# EAGLE design GKmini_SMD_final (EAGLE 7.5.0)
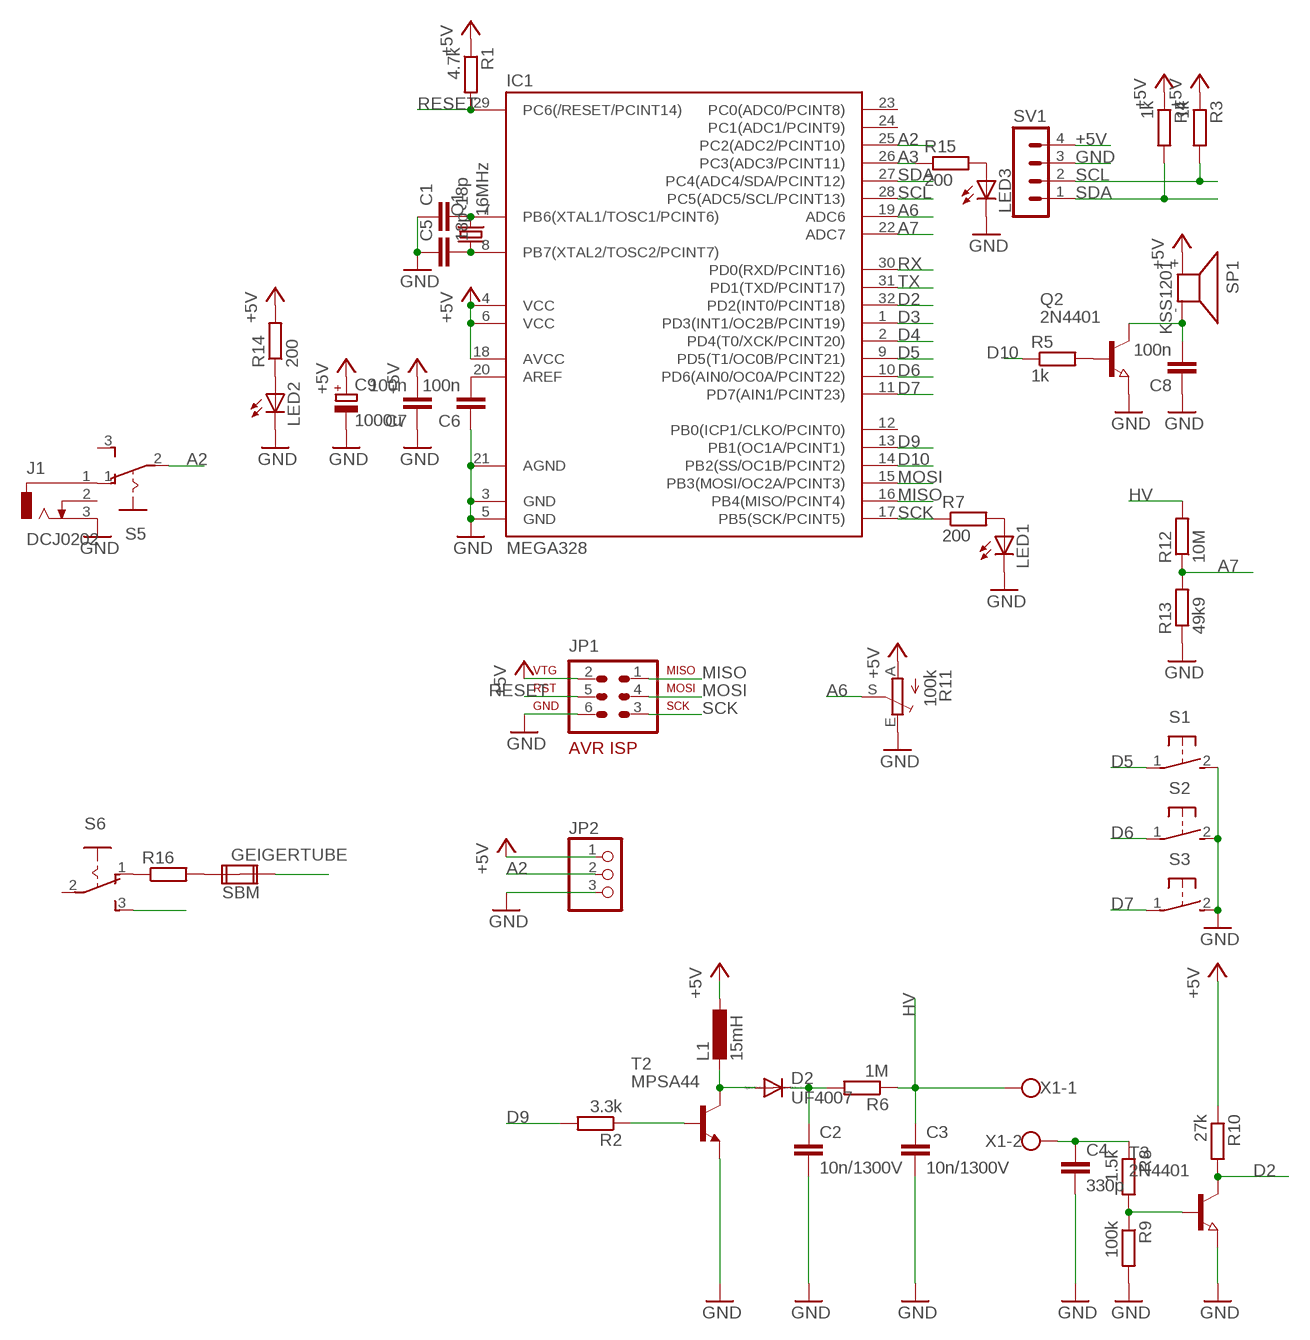
[diagram p0: schematic, sheet 1]

## Parts
C1  18p  C-EUC0805  [C0805]
C2  10n/1300V  C-EU150-054X183  [C150-054X183]
C3  10n/1300V  C-EU150-054X183  [C150-054X183]
C4  330p  C-EUC0805K  [C0805K]
C5  18p  C-EUC0805  [C0805]
C6  100n  C-EUC0805  [C0805]
C7  100n  C-EUC0805  [C0805]
C8  100n  C-EUC0805  [C0805]
C9  1000u  CPOL-EU153CLV-1012  [153CLV-1012]
D2  UF4007  DIODE-C1702-05  [C1702-05]
GEIGERTUBE  SBM  SBM21  [SBM]
IC1  MEGA328  MEGA48/88/168-AU  [TQFP32-08]
J1  DCJ0202  [DCJ0202]
JP1  AVR-ISP-6R  [AVR-ISP-6R]
JP2  PINHD-1X3  [1X03]
L1  15mH  L-EU6000-XXX-RC  [6000-XXXX-RC]
LED1  LED3MM  [LED3MM]
LED2  LED3MM  [LED3MM]
LED3  LED3MM  [LED3MM]
Q1  16MHz  CRYSTALHC49UP  [HC49UP]
Q2  2N4401  NPN-TRANSISTOR_SOT23W  [SOT23W]
R1  4.7k  R-EU_R0805  [R0805]
R2  3.3k  R-EU_R0805  [R0805]
R3  1k  R-EU_R0805  [R0805]
R4  1k  R-EU_R0805  [R0805]
R5  1k  R-EU_R0805  [R0805]
R6  1M  R-EU_0207/5V  [0207/5V]
R7  200  R-EU_R0805  [R0805]
R8  1.5k  R-EU_R0805W  [R0805W]
R9  100k  R-EU_R0805W  [R0805W]
R10  27k  R-EU_R0805W  [R0805W]
R11  100k  TRIM_EU-S64Y  [S64Y]
R12  10M  R-EU_R0805  [R0805]
R13  49k9  R-EU_R0805  [R0805]
R14  200  R-EU_R0805  [R0805]
R15  200  R-EU_R0805  [R0805]
R16  R-EU_R1206W  [R1206W]
S1  31-XX  [B3F-31XX]
S2  31-XX  [B3F-31XX]
S3  31-XX  [B3F-31XX]
S5  255SB  [255SB]
S6  255SB  [255SB]
SP1  KSS1201  [KSS1201]
SV1  MA04-1  [MA04-1]
T2  MPSA44  2N2222  [TO92-EBC-OVAL]
T3  2N4401  NPN-TRANSISTOR_SOT23W  [SOT23W]
X1  W237-102  [W237-102]

## Nets
+5V: C7.2 C9.+ IC1.4(VCC) IC1.6(VCC) IC1.18(AVCC) JP1.2 JP2.1 L1.1 R1.1 R3.1 R4.1 R10.1 R11.A R14.2 SP1.+ SV1.4
A2: IC1.25(PC2(ADC2/PCINT10)) JP2.2 S5.2(P)
A3: IC1.26(PC3(ADC3/PCINT11)) R15.1
A6: IC1.19(ADC6) R11.S
A7: IC1.22(ADC7) R12.1 R13.2
D2: IC1.32(PD2(INT0/PCINT18)) R10.2 T3.2(C)
D3: IC1.1(PD3(INT1/OC2B/PCINT19))
D4: IC1.2(PD4(T0/XCK/PCINT20))
D5: IC1.9(PD5(T1/OC0B/PCINT21)) S1.1(P)
D6: IC1.10(PD6(AIN0/OC0A/PCINT22)) S2.1(P)
D7: IC1.11(PD7(AIN1/PCINT23)) S3.1(P)
D9: IC1.13(PB1(OC1A/PCINT1)) R2.2
D10: IC1.14(PB2(SS/OC1B/PCINT2)) R5.1
GND: C1.1 C2.2 C3.2 C4.2 C5.1 C6.1 C7.1 C8.1 C9.- IC1.3(GND) IC1.5(GND) IC1.21(AGND) J1.3 JP1.6 JP2.3 LED1.K(C) LED2.K(C) LED3.K(C) Q2.3(E) R9.2 R11.E R13.1 S1.2(S) S2.2(S) S3.2(S) SV1.3 T2.E T3.3(E)
HV: C3.1 R6.1 R12.2 X1.1
MISO: IC1.16(PB4(MISO/PCINT4)) JP1.1
MOSI: IC1.15(PB3(MOSI/OC2A/PCINT3)) JP1.4
N$1: C1.2 IC1.7(PB6(XTAL1/TOSC1/PCINT6)) Q1.2
N$2: C5.2 IC1.8(PB7(XTAL2/TOSC2/PCINT7)) Q1.1
N$3: C6.2 IC1.20(AREF)
N$4: Q2.1(B) R5.2
N$5: C8.2 Q2.2(C) SP1.-
N$6: LED1.A R7.2
N$7: D2.A L1.2 T2.C
N$8: C2.1 D2.C R6.2
N$9: LED2.A R14.1
N$10: R2.1 T2.B
N$11: C4.1 R8.1 X1.2
N$12: R8.2 R9.1 T3.1(B)
N$13: R16.1 S6.1(O)
N$14: LED3.A R15.2
N$15: J1.1 S5.1(O)
N$16: GEIGERTUBE.1A R16.2
N$17: S6.3(S)
N$18: GEIGERTUBE.2A
RESET: IC1.29(PC6(/RESET/PCINT14)) JP1.5 R1.2
RX: IC1.30(PD0(RXD/PCINT16))
SCK: IC1.17(PB5(SCK/PCINT5)) JP1.3 R7.1
SCL: IC1.28(PC5(ADC5/SCL/PCINT13)) R3.2 SV1.2
SDA: IC1.27(PC4(ADC4/SDA/PCINT12)) R4.2 SV1.1
TX: IC1.31(PD1(TXD/PCINT17))
Unconnected: GEIGERTUBE.1B GEIGERTUBE.2B IC1.12(PB0(ICP1/CLKO/PCINT0)) IC1.23(PC0(ADC0/PCINT8)) IC1.24(PC1(ADC1/PCINT9)) J1.2 S5.3(S) S6.2(P)

## Library data of the parts
C1 C4-C8 = rcl:C-EU: CAPACITOR, European symbol
C2 C3 = rcl-igi:C-EU: CAPACITOR, European symbol
C9 = rcl-igi:CPOL-EU: POLARIZED CAPACITOR, European symbol
D2 = diode:DIODE-: DIODE
GEIGERTUBE = special-igi:SBM21: FUSE 5 x 20 mm
IC1 = avr-6:MEGA48/88/168
J1 = con-jack-igi:DCJ0202: DC POWER JACK Source: DCJ0202.pdf; OC_FARNELL: unknown; OC_NEWARK: unknown
JP1 = avr-6:AVR-ISP-6: AVR ISP-6 Serial Programming Header
JP2 = adafruit:PINHD-1X3: PIN HEADER
L1 = rcl:L-EU: INDUCTOR, European symbol
LED1-LED3 = led:LED: LED OSRAM: - CHIPLED LG R971, LG N971, LY N971, LG Q971, LY Q971, LO R971, LY R971 LH N974, LH R974 LS Q976, LO Q976, LY Q976 LO Q996 - Hyper CHIPLED LW Q18S LB Q993, LB Q99A, LB R99A - SideLED LS A670, LO A670, LY A670, LG A670, LP A670 LB A673, LV A673, LT A673, LW A673 LH A674 LY A675 LS A676, LA A676, LO A676, LY A676, LW A676 LS A679, LY A679, LG A679 - Hyper Micro SIDELED® LS Y876, LA Y876, LO Y876, LY Y876 LT Y87S - SmartLED LW L88C, LW L88S LB L89C, LB L89S, LG L890 LS L89K, LO L89K, LY L89K LS L896, LA L896, LO L896, LY L896 - TOPLED LS T670, LO T670, LY T670, LG T670, LP T670 LSG T670, LSP T670, LSY T670, LOP T670, LYG T670 LG T671, LOG T671, LSG T671 LB T673, LV T673, LT T673, LW T673 LH T674 LS T676, LA T676, LO T676, LY T676, LB T676, LH T676, LSB T676, LW T676 LB T67C, LV T67C, LT T67C, LS T67K, LO T67K, LY T67K, LW E67C LS E67B, LA E67B, LO E67B, LY E67B, LB E67C, LV E67C, LT E67C LW T67C LS T679, LY T679, LG T679 LS T770, LO T770, LY T770, LG T770, LP T770 LB T773, LV T773, LT T773, LW T773 LH T774 LS E675, LA E675, LY E675, LS T675 LS T776, LA T776, LO T776, LY T776, LB T776 LHGB T686 LT T68C, LB T68C - Hyper Mini TOPLED® LB M676 - Mini TOPLED Santana® LG M470 LS M47K, LO M47K, LY M47K Source: http://www.osram.convergy.de LUXEON: - LUMILED® LXK2-PW12-R00, LXK2-PW12-S00, LXK2-PW14-U00, LXK2-PW14-V00 LXK2-PM12-R00, LXK2-PM12-S00, LXK2-PM14-U00 LXK2-PE12-Q00, LXK2-PE12-R00, LXK2-PE12-S00, LXK2-PE14-T00, LXK2-PE14-U00 LXK2-PB12-K00, LXK2-PB12-L00, LXK2-PB12-M00, LXK2-PB14-N00, LXK2-PB14-P00, LXK2-PB14-Q00 LXK2-PR12-L00, LXK2-PR12-M00, LXK2-PR14-Q00, LXK2-PR14-R00 LXK2-PD12-Q00, LXK2-PD12-R00, LXK2-PD12-S00 LXK2-PH12-R00, LXK2-PH12-S00 LXK2-PL12-P00, LXK2-PL12-Q00, LXK2-PL12-R00 Source: www.luxeon.com KINGBRIGHT: KA-3528ASYC Source: www.kingbright.com
Q1 = crystal:CRYSTAL: CRYSTAL; OC_FARNELL: unknown; OC_NEWARK: unknown
Q2 T3 = semicon-smd-ipc:NPN-TRANSISTOR_: NPN TRANSISTOR
R1-R5 R7-R10 R12-R15 = rcl:R-EU_: RESISTOR, European symbol
R6 = rcl-igi:R-EU_: RESISTOR, European symbol
R11 = pot:TRIM_EU-: POTENTIOMETER
R16 = resistor:R-EU_: RESISTOR, European symbol
S1-S3 = switch-omron:31-XX: OMRON SWITCH; MPN: B3F-3100; OC_FARNELL: 959704; OC_NEWARK: 36M3582
S5 S6 = switch-igi:255SB: SLIDING SWITCH Distributor Buerklin, 11G810
SP1 = buzzer:KSS1201: SPEAKER Source: Schukat; OC_FARNELL: unknown; OC_NEWARK: unknown
SV1 = con-lstb:MA04-1: PIN HEADER; OC_FARNELL: unknown; OC_NEWARK: unknown
T2 = adafruit:2N2222: NPN TRANSISTOR Big oval pads
X1 = con-wago-500:W237-102: WAGO SCREW CLAMP; MPN: 237-102; OC_FARNELL: unknown; OC_NEWARK: 70K9898

## Board
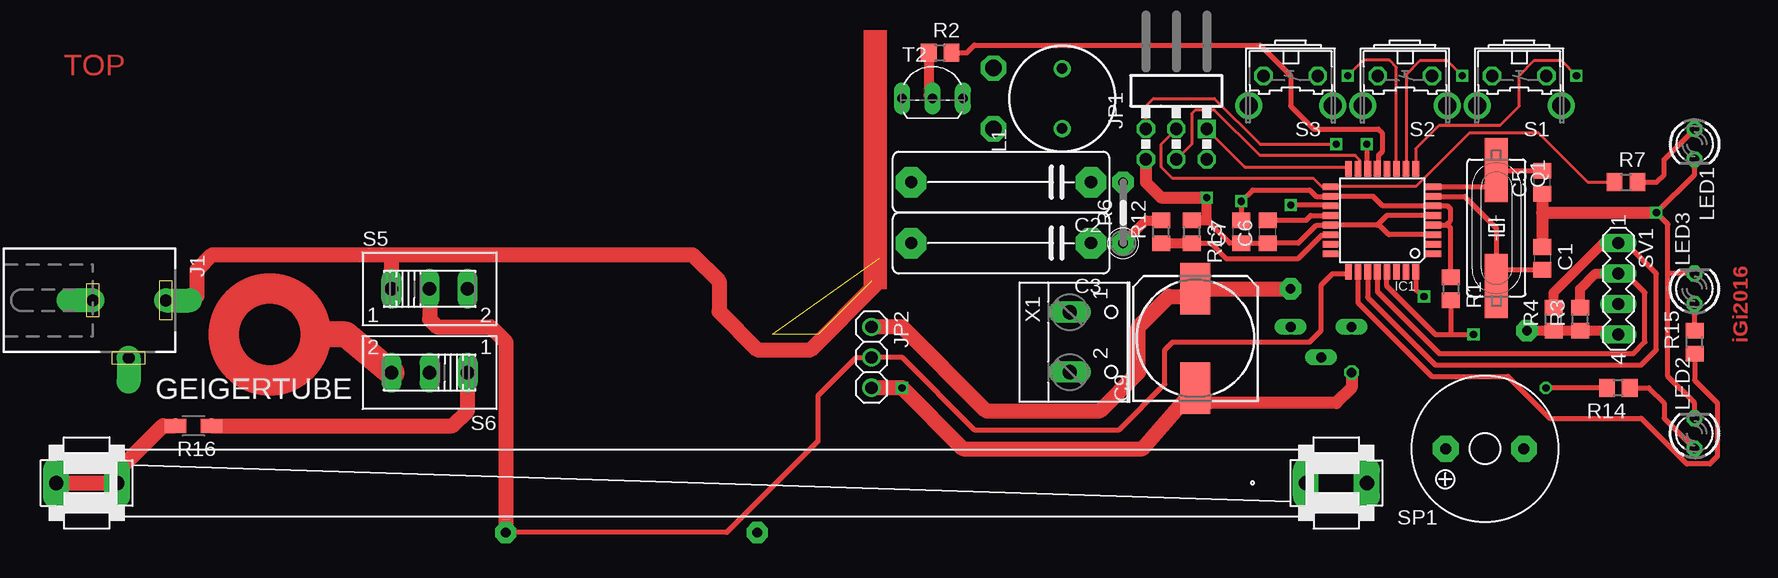
[diagram p1: board, top side]
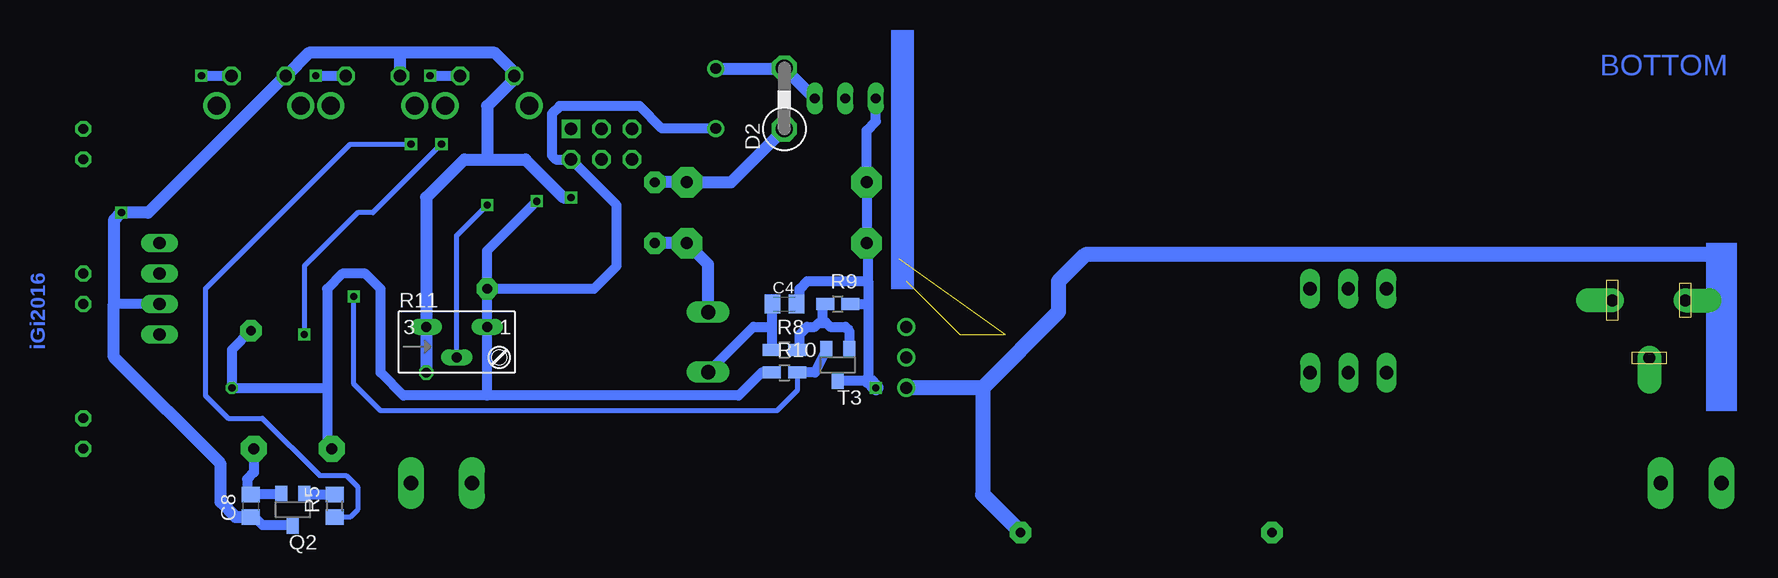
[diagram p2: board, bottom side, seen from below]

No outline drawn. Coordinates in mm, seen from the top.
Copper layers (1*16): Top 0.035mm / dielectric 1.5mm / Bottom 0.035mm
Design rules "default *": minimum track width 10mil, minimum drill 24mil, track to track 8mil, track to pad 8mil, pad to pad 8mil, via to via 8mil, smd to smd 8mil, copper to edge 40mil, drill to drill 8mil, minimum pad ring 10mil, minimum via ring 8mil, stop-mask expansion 4mil, vias tented up to drill 0mil, thermal gap 20mil

### Footprints (pad centres in the part's own frame; a part is rotated, then mirrored left to right if it is on the bottom)
C0805 = smd 1.3 x 1.5: 1 -0.95,0; 2 0.95,0
C150-054X183 = drill 1.016 pad 2.54 octagon: 1 -7.493,0; 2 7.493,0
C0805K = smd 1.3 x 1.6: 1 -1,0; 2 1,0
153CLV-1012 = smd 4.3 x 2.5: + 4.15,0; - -4.15,0
C1702-05 = drill 1.397 octagon: A 2.54,0; C -2.54,0
SBM = drill 1.194 pad 2.184 long: 1A -10.16,0; 1B -5.08,0; 2A 99.06,0; 2B 93.98,0
TQFP32-08 = smd 1.27 x 0.559: 1 -4.293,2.8; 2 -4.293,2; 3 -4.293,1.2; 4 -4.293,0.4; 5 -4.293,-0.4; 6 -4.293,-1.2; 7 -4.293,-2; 8 -4.293,-2.8; 17 4.293,-2.8; 18 4.293,-2; 19 4.293,-1.2; 20 4.293,-0.4; 21 4.293,0.4; 22 4.293,1.2; 23 4.293,2; 24 4.293,2.8 | smd 0.559 x 1.27: 9 -2.8,-4.293; 10 -2,-4.293; 11 -1.2,-4.293; 12 -0.4,-4.293; 13 0.4,-4.293; 14 1.2,-4.293; 15 2,-4.293; 16 2.8,-4.293; 25 2.8,4.293; 26 2,4.293; 27 1.2,4.293; 28 0.4,4.293; 29 -0.4,4.293; 30 -1.2,4.293; 31 -2,4.293; 32 -2.8,4.293
DCJ0202 = drill 1 pad 2 offset: 1 0,3.1; 2 4.8,0; 3 0,-3
AVR-ISP-6R = drill 1.016 square: 1 -2.54,-1.27 | drill 1.016 octagon: 2 -2.54,1.27; 3 0,-1.27; 4 0,1.27; 5 2.54,-1.27; 6 2.54,1.27
1X03 = drill 1.016: 1 -2.54,0; 2 0,0; 3 2.54,0
6000-XXXX-RC = drill 0.9 pad 1.422: 1 -2.5,0; 2 2.5,0
LED3MM = drill 0.813 octagon: A -1.27,0; K 1.27,0
HC49UP = smd 5.334 x 1.93: 1 -4.826,0; 2 4.826,0
SOT23W = smd 1 x 1.4: 1 -0.95,-1.303; 2 0.95,-1.303; 3 0,1.303
R0805 = smd 1.3 x 1.5: 1 -0.95,0; 2 0.95,0
0207/5V = drill 0.813 pad 1.778 octagon: 1 -2.54,0; 2 2.54,0
R0805W = smd 1.5 x 1: 1 -1.052,0; 2 1.052,0
S64Y = drill 0.813 long: A 2.54,1.27; E -2.54,1.27; S 0,-1.27
R1206W = smd 1.8 x 1.2: 1 -1.499,0; 2 1.499,0
B3F-31XX = drill 1.016 octagon: 1 -2.261,-1.245; 2 2.261,-1.245 | drill 1.499 pad 2.159: 3 -3.505,1.245; 4 3.505,1.245
255SB = drill 1.118 long: 1 -3.175,0; 2 0,0; 3 3.175,0
KSS1201 = drill 0.914 pad 2.159 octagon: + 3.251,0; - -3.251,0
MA04-1 = drill 1.016 long: 1 -3.81,0; 2 -1.27,0; 3 1.27,0; 4 3.81,0
TO92-EBC-OVAL = drill 0.813 long: B 0,-1.27; C 2.54,-1.27; E -2.54,-1.27
W237-102 = drill 1.194 long: 1 -2.5,-1.27; 2 2.5,-1.27

### Placement (x,y rotation side)
C1  125.09,24.13 270 top
C2  80.01,30.48 180 top
C3  80.01,25.4 180 top
C4  79.38,20.32 0 bottom
C5  125.09,30.48 90 top
C6  102.23,26.35 90 top
C7  100.01,26.35 90 top
C8  123.83,3.49 90 bottom
C9  96.2,17.46 90 top
D2  79.38,37.47 90 bottom
GEIGERTUBE  11.43,5.4 0 top
IC1  111.76,27.3 180 top
J1  7.3,20.64 270 top
JP1  94.61,33.66 180 top
JP2  69.22,15.88 270 top
L1  85.09,37.47 90 top
LED1  137.79,33.66 270 top
LED2  137.79,9.53 90 top
LED3  137.79,21.59 90 top
Q1  121.28,26.67 270 top
Q2  120.33,3.17 180 bottom
R1  117.47,21.59 270 top
R2  74.93,41.27 0 top
R3  128.27,19.05 90 top
R4  126.05,19.05 90 top
R5  116.84,3.49 90 bottom
R6  90.17,27.94 90 top
R7  132.08,30.48 0 top
R8  79.38,16.51 0 bottom
R9  74.93,20.32 0 bottom
R10  79.38,14.61 0 bottom
R11  106.68,17.14 0 bottom
R12  93.34,26.35 90 top
R13  95.89,26.35 270 top
R14  131.44,13.34 180 top
R15  137.79,17.14 90 top
R16  12.7,10.16 180 top
S1  123.19,38.1 180 top
S2  113.67,38.1 180 top
S3  104.14,38.1 180 top
S5  32.38,21.59 0 top
S6  32.38,14.61 180 top
SP1  120.33,8.26 180 top
SV1  131.44,21.59 270 top
T2  74.3,38.73 0 top
T3  74.93,15.24 180 bottom
X1  87,17.14 270 top

### Tracks (layer width: path | path; a pad name or v marks a point on that pad's centre or on a via)
+5V  (via drill 0.6, 0.8 pad 1.78)
  Top 0.406: IC1.4 117.08,26.91 117.16,26.99 | 117.16,26.99 117.47,27.3 117.47,28.26 117.23,28.5 IC1.6 111.83,28.5 111.03,29.3 IC1.18 106.27,29.3 105.73,29.84 100.97,29.84 v100.01,28.89 C7.2 | R1.1 117.47,26.67 117.16,26.99 | R3.1 R4.1 | R14.2 v125.41,13.34
  Top 0.813: C9.+ 95.89,20.95 | SV1.4 131.12,18.1 R4.1 v123.83,18.1
  Top 1.27: 95.89,20.95 93.98,20.95 91.44,18.41 91.44,14.61 88.27,11.43 78.74,11.43 71.75,18.41 JP2.1 | 95.89,20.95 96.18,20.95 C9.+ | 95.89,20.95 96.52,21.59 v104.14,21.59
  Bottom 0.813: R10.1 81.28,14.61 83.19,12.7 104.14,12.7 | 104.14,12.7 111.12,12.7 113.03,14.61 113.03,21.59 114.3,22.86 116.2,22.86 117.47,21.59 117.47,13.34 | v104.14,21.59 95.25,21.59 93.34,23.5 93.34,28.57 JP1.2 98.42,32.38 98.74,32.7 98.74,36.2 98.11,36.83 91.44,36.83 89.58,34.97 L1.1 | v104.14,21.59 104.14,24.77 v100.01,28.89 | 104.14,12.7 R11.A v104.14,21.59 | v123.83,18.1 125.41,16.51 v125.41,13.34 117.47,13.34 | 117.47,13.34 117.47,8.26 SP1.+
A2  (via drill 0.8 pad 1.78)
  Top 0.406: IC1.25 108.81,22.86 107.63,22.86 106.68,21.91 106.68,18.1 105.73,17.14 94.3,17.14 93.66,16.51 93.66,13.65 89.85,9.84 77.79,9.84 71.75,15.88 JP2.2 67.94,15.88 64.77,12.7 64.77,8.89 57.15,1.27 v38.73,1.27
  Top 1.27: S5.2 32.38,19.05 33.02,18.41 37.47,18.41 38.73,17.14 v38.73,1.27
A3
  Top 0.406: R15.1 137.79,13.97 139.7,12.06 139.7,7.62 139.06,6.99 137.16,6.99 133.35,10.79 125.73,10.79 122.24,14.29 115.89,14.29 109.76,20.41 IC1.26
A6  (via drill 0.6)
  Top 0.406: IC1.19 107.4,28.57 v104.14,28.57
  Bottom 0.406: R11.S 106.68,26.04 v104.14,28.57
A7
  Top 0.406: IC1.22 107.4,26.04 106.68,26.04 104.78,24.13 98.74,24.13 97.47,25.4 R13.2
  Top 0.813: R12.1 R13.2
D2  (via drill 0.6)
  Top 0.406: IC1.32 114.56,21.53 v115.25,20.95
  Bottom 0.406: R10.2 78.32,13.12 80.01,11.43 113.03,11.43 115.25,13.65 v115.25,20.95
  Bottom 0.813: T3.2 76.83,14.61 R10.2
D5  (via drill 0.6)
  Top 0.254: IC1.9 114.56,33.28 116.52,35.24 121.6,35.24 123.19,36.83 123.19,39.37 124.46,40.64 126.68,40.64 v127.95,39.37
  Bottom 0.813: v127.95,39.37 125.48,39.37 S1.1
D6  (via drill 0.6)
  Top 0.254: IC1.10 113.76,39.47 114.94,40.64 117.16,40.64 v118.43,39.37
  Bottom 0.254: 115.95,39.37 S2.1
  Bottom 0.813: v118.43,39.37 115.95,39.37
D7  (via drill 0.6)
  Top 0.254: IC1.11 112.96,40.08 112.39,40.64 110.17,40.64 v108.9,39.37
  Bottom 0.254: 106.43,39.37 S3.1
  Bottom 0.813: v108.9,39.37 106.43,39.37
D9
  Top 0.406: R2.2 77.15,41.27 77.79,41.91 101.6,41.91 104.14,39.37 104.14,36.83 106.05,34.92 111.44,34.92 111.76,34.61 111.76,33.02 111.44,32.7 111.44,31.68 IC1.13
D10  (via drill 0.6)
  Top 0.406: v110.49,33.66 110.49,31.67 IC1.14
  Bottom 0.406: v110.49,33.66 115.57,33.66 127.64,21.59 127.64,12.7 125.73,10.79 122.87,10.79 118.11,6.03 115.89,6.03 114.94,5.08 114.94,3.17 115.57,2.54 R5.1
GND  (via drill 0.6, 0.8 pad 1.02, 0.8 pad 1.78)
  Top 0.406: IC1.5 112.16,27.7 111.44,26.99 | 111.44,26.99 111.36,26.91 IC1.21 106.28,26.91 104.78,25.4 101.92,25.4 C6.1 C7.1 99.06,25.4 97.16,27.3 | IC1.3 112.33,26.11 111.44,26.99 | R13.1 | LED2.K 137.79,12.06 135.57,14.29 135.57,22.86 | 135.57,22.86 135.57,26.99 v134.62,27.94 137.79,31.11 LED1.K | LED3.K 135.57,22.86
  Top 0.813: v97.16,29.21 97.16,27.3 R13.1
  Top 1.016: C5.1 125.09,27.94 | 125.09,27.94 v134.62,27.94 | 125.09,27.94 C1.1 | C9.- 97.45,12.06 107.95,12.06 109.22,13.34 v109.22,14.61 | JP1.6 92.08,30.48 93.34,29.21 v97.16,29.21
  Top 1.27: C9.- 91.78,8.26 76.83,8.26 v71.75,13.34 JP2.3
  Bottom 0.813: C4.2 78.11,20.59 78.11,21.59 77.47,22.23 72.39,22.23 | 72.39,22.23 72.39,20.32 | 72.39,20.32 72.39,13.97 72.42,13.94 T3.3 | R9.2 72.39,20.32 | T2.E 71.75,35.56 72.52,34.8 C2.2 C3.2 72.39,25.27 72.39,22.23 | C8.1 123.51,2.54 122.87,1.91 120.36,1.91 Q2.3 | SV1.3 135.25,20.32
  Bottom 1.016: 111.12,41.27 103.5,41.27 101.88,39.65 S3.2 101.88,39.09 104.14,36.83 104.14,32.38 | 111.12,41.27 119,41.27 S1.2 120.99,39.34 132.4,27.94 v134.62,27.94 135.25,27.3 135.25,20.32 135.25,15.88 126.36,6.99 126.36,3.81 125.1,2.54 C8.1 | S2.2 111.4,41 111.12,41.27 | 104.14,32.38 106.05,32.38 109.22,29.21 R11.E v109.22,14.61 | 104.14,32.38 100.97,32.38 97.79,29.21 v97.16,29.21
  Bottom 1.27: 72.42,13.94 72.36,13.94 v71.75,13.34 | J1.3 1.27,20.64 1.27,24.45 54.29,24.45 56.52,22.23 56.52,19.68 62.87,13.34 | 62.87,13.34 JP2.3 | 62.87,13.34 62.87,4.45 v59.69,1.27
HV
  Top 0.813: R12.2 92.71,27.3 92.08,27.3 R6.1
  Bottom 1.016: X1.1 85.72,23.62 C3.1 R6.1
MISO
  Top 0.254: 108.9,31.11 108.96,31.17 IC1.16 108.81,31.75 100.33,31.75 JP1.1
MOSI
  Top 0.254: IC1.15 109.86,31.6 109.86,32.38 109.54,32.7 101.6,32.7 97.79,36.51 96.2,36.51 95.89,36.2 95.89,33.66 JP1.4
N$1
  Top 0.406: IC1.7 118.65,29.3 121.28,26.67 Q1.2 121.99,23.18 C1.2
N$2
  Top 0.406: IC1.8 120.91,30.11 121.28,30.48 121.28,31.11 | 121.28,31.11 Q1.1 | C5.2 121.6,31.43 121.28,31.11
N$3
  Top 0.406: C6.2 101.92,27.3 105.41,27.3 105.81,27.7 IC1.20
N$4
  Bottom 0.406: 119.35,4.44 Q2.1
  Bottom 0.813: 119.35,4.44 R5.2
N$5
  Bottom 0.406: 123.79,4.48 C8.2
  Bottom 0.813: SP1.- 123.58,6.27 124.14,5.71 124.14,4.76 C8.2 | 123.79,4.48 Q2.2
N$6
  Top 0.406: R7.2 134.62,30.48 135.25,31.11 135.25,32.38 LED1.A
N$7
  Bottom 1.016: L1.2 79.42,39.97 D2.A T2.C
N$8
  Bottom 1.016: D2.C 83.82,30.48 C2.1 R6.2
N$9
  Top 0.406: R14.1 133.99,13.34 135.25,12.06 135.25,10.79 LED2.A
N$10
  Top 0.813: R2.1 73.98,37.78 T2.B
N$11
  Bottom 0.813: C4.1 80.43,20.27 80.43,18.41 | 80.43,18.41 R8.1 | X1.2 81.95,18.41 80.43,18.41
N$12
  Bottom 0.813: R9.1 76.2,20.1 76.2,19.05 75.88,18.73 | 75.88,18.73 75.56,18.41 74.3,18.41 73.98,18.1 T3.1 | R8.2 78.11,16.73 78.11,17.78 77.47,18.41 76.83,18.41 76.52,18.73 75.88,18.73
N$13
  Top 1.27: R16.1 34.29,10.16 35.56,11.43 S6.1
N$14
  Top 0.406: R15.2 LED3.A
N$15  (3 unrouted)
  Top 1.27: J1.1 11.99,20.95 13.02,20.95 13.02,23.18 14.29,24.45 29.21,24.45 | 29.21,24.45 S5.1 | 29.21,24.45 54.29,24.45 56.52,22.23 56.52,19.68 59.69,16.51 64.14,16.51 69.53,21.91 69.53,23.81 69.85,24.13
N$16
  Top 1.27: GEIGERTUBE.1A 6.03,5.4 6.35,5.71 6.35,6.35 10.16,10.16 R16.2
N$17
  Top 2.184: S6.3 25.4,17.78 22.86,17.78
RESET  (via drill 0.6)
  Top 0.254: JP1.5 92.08,36.83 92.71,37.47 97.79,37.47 101.6,33.66 v107.95,33.66
  Top 0.406: IC1.29 112.16,21.82 116.2,17.78 117.47,17.78 | 117.47,17.78 v119.38,17.78 | R1.2 117.47,17.78
  Bottom 0.406: v107.95,33.66 113.67,27.94 114.94,27.94 119.38,23.5 v119.38,17.78
SCK
  Top 0.254: R7.1 128.91,30.48 124.78,34.61 119.06,34.61 114.62,30.16 107.53,30.16 IC1.17 106.74,30.11 106.05,30.8 94.3,30.8 93.34,31.75 93.34,33.66 JP1.3
SCL
  Top 0.406: IC1.28 111.36,21.36 116.52,16.19 132.72,16.19 133.67,17.14 133.67,21.27 132.08,22.86 SV1.2
  Top 0.813: R3.2 128.27,21.59 129.54,22.86 SV1.2
SDA
  Top 0.406: SV1.1 132.08,25.4 134.62,22.86 134.62,16.51 133.35,15.24 116.2,15.24 110.56,20.89 IC1.27
  Top 0.813: R4.2 126.05,21.27 130.18,25.4 SV1.1
(copper drawn outside any net)
  shapes: Bottom area x2, Top area x1, Top circle x1

### Text on the board
Top: TOP | iGi2016
Bottom: BOTTOM | iGi2016